# Altium schematic sheet HighSpeedInterfaces.SchDoc: High Speed Interfaces
size A3; ApprovedBy: Diogo Gomes; CheckedBy: Bruno, Candido, Pedro; Author: João Vieira; CompanyName: LART; DrawnBy: João Vieira; Organization: LART; Address1: Morro do lena; Address2: Alto Do Vieiro; Address3: APT 4163, Building D; Revision: v1.4.2; SheetNumber: 7; SheetTotal: 12; ProjectTitle: Autonomous Control Unit; CheckedBy1: G. Candido; CheckedBy2: F. Chen; CheckedBy3: P. Ferreira; CheckedBy4: B. Vicente; CheckedBy5: _; CheckedBy6: _; CheckedBy7: _; CHK_APP_DATE: --/--/--; DSN_APP_DATE: --/--/--; ENG_APP_DATE: --/--/--; Summary: The various High Speed IOs, for now this only includes Ethernet; version_tag: 1.4.2; ImagePath: C:\Users\micron\Desktop
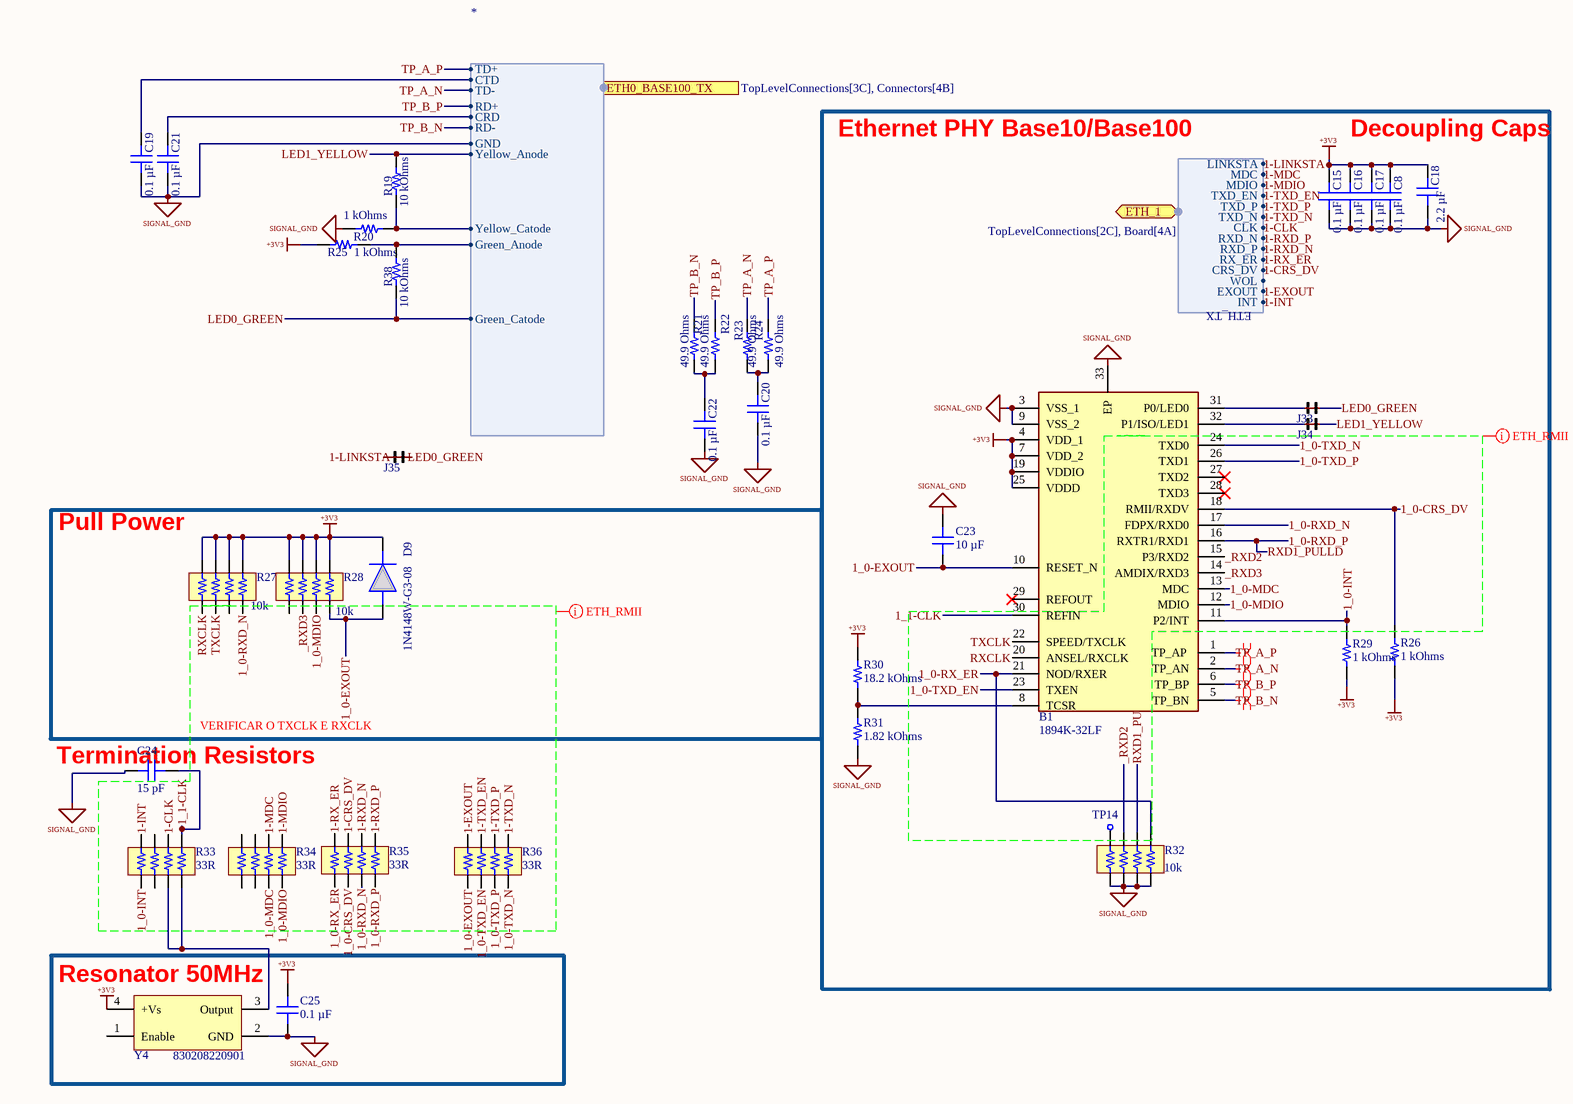
[diagram p0: HighSpeedInterfaces.SchDoc]

## Parts
B1  1894K-32LF  [1894K-32LF]
C8  0.1 µF  [CAP 0402_1005]
C15  0.1 µF  [CAP 0402_1005]
C16  0.1 µF  [CAP 0402_1005]
C17  0.1 µF  [CAP 0402_1005]
C18  2.2 µF  [CAP 0805_2012]
C19  0.1 µF  [CAP 0402_1005]
C20  0.1 µF  [CAP 0402_1005]
C21  0.1 µF  [CAP 0402_1005]
C22  0.1 µF  [CAP 0402_1005]
C23  10 µF  [CAP 0805_2012]
C24  15 pF  [CAP 0402_1005]
C25  0.1 µF  [CAP 0402_1005]
D9  1N4148W-G3-08  [SOD3716X135N]
J33  A solder Bridge  [Solder Bridge 805]  (value not drawn)
J34  A solder Bridge  [Solder Bridge 805]  (value not drawn)
J35  A solder Bridge  [Solder Bridge 805]  (value not drawn)
R19  10 kOhms  [RES 0805_2012]
R20  1 kOhms  [RES 0805_2012]
R21  49.9 Ohms  [RES 0402_1005]
R22  49.9 Ohms  [RES 0402_1005]
R23  49.9 Ohms  [RES 0402_1005]
R24  49.9 Ohms  [RES 0402_1005]
R25  1 kOhms  [RES 0805_2012]
R26  1 kOhms  [RES 0805_2012]
R27  10k  [RESNET 1206-8 CONVEX]
R28  10k  [RESNET 1206-8 CONVEX]
R29  1 kOhms  [RES 0805_2012]
R30  18.2 kOhms  [RES 0805_2012]
R31  1.82 kOhms  [RES 0805_2012]
R32  10k  [RESNET 1206-8 CONVEX]
R33  33R  [RESNET 0804-8 CONVEX]
R34  33R  [RESNET 0804-8 CONVEX]
R35  33R  [RESNET 0804-8 CONVEX]
R36  33R  [RESNET 0804-8 CONVEX]
R38  10 kOhms  [RES 0805_2012]
TP14  TestPad  [Test Pad Small]  (value not drawn)
Y4  830208220901  [WE-SPXO_IQXO-791]

## Blocks framed on the sheet
Pull Power: D9 R27 R28
Resonator 50MHz: C25 Y4

## Ports
ETH0_BASE100_TX (harness *, see TopLevelConnections[3C], Connectors[4B]), ETH_1 (bidir, harness ETH_TX, see TopLevelConnections[2C], Board[4A])

## Harnesses
ETH_TX: MDC, MDIO, TXD_EN, TXD_P, TXD_N, CLK, RXD_N, RXD_P, RX_ER, LINKSTA, CRS_DV, WOL, EXOUT, INT
*: TD+, CTD, TD-, RD+, CRD, RD-, GND, Yellow_Anode, Yellow_Catode, Green_Anode, Green_Catode

## Nets
+3V3: B1.4(VDD_1) B1.7(VDD_2) B1.19(VDDIO) B1.25(VDDD) C8.2 C15.2 C16.2 C17.2 C18.2 C25.1 D9.1(K) R25.2 R26.2 R27.1 R27.2 R27.3 R27.4 R28.5 R28.6 R28.7 R28.8 R29.2 R30.2 Y4.4(+Vs)
SIGNAL_GND: B1.3(VSS_1) B1.9(VSS_2) B1.33(EP) C8.1 C15.1 C16.1 C17.1 C18.1 C19.1 C20.1 C21.1 C22.1 C23.2 C24.2 C25.2 R20.2 R31.1 R32.1 R32.2 R32.3 R32.4 Y4.2(GND) ; port ETH0_BASE100_TX.GND
1-CLK: R33.6 ; port ETH_1.CLK
1-CRS_DV: R35.7 ; port ETH_1.CRS_DV
1-EXOUT: R36.8 ; port ETH_1.EXOUT
1-INT: R33.8 ; port ETH_1.INT
1-LINKSTA: J35.P0 ; port ETH_1.LINKSTA
1-MDC: R34.6 ; port ETH_1.MDC
1-MDIO: R34.5 ; port ETH_1.MDIO
1-RX_ER: R35.8 ; port ETH_1.RX_ER
1-RXD_N: R35.6 ; port ETH_1.RXD_P
1-RXD_P: R35.5 ; port ETH_1.RXD_N
1-TXD_EN: R36.7 ; port ETH_1.TXD_EN
1-TXD_N: R36.5 ; port ETH_1.TXD_N
1-TXD_P: R36.6 ; port ETH_1.TXD_P
1_0-CRS_DV: B1.18(RMII/RXDV) R26.1 R35.2
1_0-EXOUT: B1.10(RESET_N) C23.1 D9.2(A) R28.4 R36.1
1_0-INT: B1.11(P2/INT) R29.1 R33.1
1_0-MDC: B1.13(MDC) R34.3
1_0-MDIO: B1.12(MDIO) R28.3 R34.4
1_0-RX_ER: B1.21(NOD/RXER) R32.5 R35.1
1_0-RXD_N: B1.17(FDPX/RXD0) R27.8 R35.3
1_0-RXD_P: B1.16(RXTR1/RXD1) R32.6 R35.4  [also labelled RXD1_PULLD]
1_0-TXD_EN: B1.23(TXEN) R36.2
1_0-TXD_N: B1.24(TXD0) R36.4
1_0-TXD_P: B1.26(TXD1) R36.3
1_1-CLK: B1.30(REFIN) C24.1 R33.5
_RXD2: B1.15(P3/RXD2) R32.7
_RXD3: B1.14(AMDIX/RXD3) R28.2
LED0_GREEN: J33.P1 J35.P1 R38.1 ; port ETH0_BASE100_TX.Green_Catode
LED1_YELLOW: J34.P1 R19.2 ; port ETH0_BASE100_TX.Yellow_Anode
RXCLK: B1.20(ANSEL/RXCLK) R27.5
TP_A_N: B1.2(TP_AN) R23.2 ; port ETH0_BASE100_TX.TD-
TP_A_P: B1.1(TP_AP) R24.2 ; port ETH0_BASE100_TX.TD+
TP_B_N: B1.5(TP_BN) R21.2 ; port ETH0_BASE100_TX.RD-
TP_B_P: B1.6(TP_BP) R22.2 ; port ETH0_BASE100_TX.RD+
TXCLK: B1.22(SPEED/TXCLK) R27.6
NetB1_8: B1.8(TCSR) R30.1 R31.2
NetB1_31: B1.31(P0/LED0) J33.P0
NetB1_32: B1.32(P1/ISO/LED1) J34.P0
NetC19_2: C19.2 ; port ETH0_BASE100_TX.CTD
NetC20_2: C20.2 R23.1 R24.1
NetC21_2: C21.2 ; port ETH0_BASE100_TX.CRD
NetC22_2: C22.2 R21.1 R22.1
NetR19_1: R19.1 R20.1 ; port ETH0_BASE100_TX.Yellow_Catode
NetR25_1: R25.1 R38.2 ; port ETH0_BASE100_TX.Green_Anode
NetR32_8: R32.8 TP14.P2
NetR33_3: R33.3 R33.4 Y4.3(Output)

Not connected (* = marked no-connect by the designer): B1 27(TXD2)* 28(TXD3)* 29(REFOUT)*; R27 7; R28 1; R33 2 7; R34 1 2 7 8; Y4 1(Enable)

## Layout directives
differential pair; rule Impedance Constraint [Min = 99.00    Max = 101.0    ]; differential pair class ETH_B; rule Matched Net Lengths [Delay Tolerance = 10ps]; rule Differential Pairs Routing [Pref Gap = 0.127mm    Min Gap  = 0.127mm    Max Gap  = 0.127mmPref Width = 0.108mm    Min Width  = 0.076mm    Max Width  = 0.108mm]: TP_B_P
differential pair; rule Impedance Constraint [Min = 99.00    Max = 101.0    ]; rule Impedance Constraint [Min = 99.00    Max = 101.0    ]; differential pair class ETH_B; rule Matched Net Lengths [Delay Tolerance = 10ps]; rule Differential Pairs Routing [Pref Gap = 0.127mm    Min Gap  = 0.127mm    Max Gap  = 0.127mmPref Width = 0.108mm    Min Width  = 0.076mm    Max Width  = 0.108mm]: TP_B_N
differential pair; differential pair class ETH_A; rule Matched Net Lengths [Delay Tolerance = 10ps]; rule Differential Pairs Routing [Pref Gap = 0.127mm    Min Gap  = 0.127mm    Max Gap  = 0.127mmPref Width = 0.108mm    Min Width  = 0.076mm    Max Width  = 0.108mm]: TP_A_P
differential pair; rule Impedance Constraint [Min = 99.00    Max = 101.0    ]; differential pair class ETH_A; rule Matched Net Lengths [Delay Tolerance = 10ps]; rule Differential Pairs Routing [Pref Gap = 0.127mm    Min Gap  = 0.127mm    Max Gap  = 0.127mmPref Width = 0.108mm    Min Width  = 0.076mm    Max Width  = 0.108mm]: TP_A_N
rule Width Constraint [Pref Impedance = 50.00ohms    Min Impedance = 50.00ohms    Max Impedance = 50.00ohms]: 1-CLK, 1-CRS_DV, 1-EXOUT, 1-INT, 1-MDC, 1-MDIO, 1-RX_ER, 1-RXD_N, 1-RXD_P, 1-TXD_EN, 1-TXD_N, 1-TXD_P, 1_0-CRS_DV, 1_0-EXOUT, 1_0-INT, 1_0-MDC, 1_0-MDIO, 1_0-RX_ER, 1_0-RXD_N, 1_0-RXD_P, 1_0-TXD_EN, 1_0-TXD_N, 1_0-TXD_P, 1_1-CLK, _RXD2, _RXD3, RXCLK, RXD1_PULLD, TXCLK

## Notes on the sheet
- Ethernet PHY Base10/Base100
- Decoupling Caps
- (near C24) VERIFICAR O TXCLK E RXCLK
- (near C24) Termination Resistors
- Title:
- Author:
- Checked By:
- Approved:
- Size:
- Date:
- Git Hash:
- A3
- Prj:
- Variant:
- SW Version:
- Description:

## Library data of the parts
B1 = 1894K-32LF: The IDT1894-32 is a low-power, physical-layer device (PHY) that supports the ISO/IEC 10Base-T and 100Base-TX Carrier-Sense Multiple Access/Collision Detection (CSMA/CD) Ethernet standards, ISO/IEC 8802-3. The IDT1894-32 is intended for MII, Node applications that require the Auto-MDIX feature that automatically corrects crossover errors in plant wiring. The IDT1894-32 incorporates Digital-Signal Processing (DSP) control in its Physical-Medium Dependent (PMD) sub layer. As a result, it can transmit and recei; Manufacturer_Name: Renesas Electronics; Geometry.Height: 1mm; Manufacturer_Part_Number: 1894K-32LF; Mouser Part Number: 972-1894K-32LF; Mouser Price/Stock: https://www.mouser.co.uk/ProductDetail/Renesas-IDT/1894K-32LF?qs=JcGQCygHkIbsoRijcJxryA%3D%3D; Arrow Part Number: *; Arrow Price/Stock: *; Datasheet Link: https://www.idt.com/document/dst/1894-32-datasheet
C8 C15-C17 C19-C22 C25 = CL05B104KP5VPNC: CAP CER 100NF 10V X7R 0402; manufacturer: Samsung Electro-Mechanics; Tolerance: ±10%; Part Number: CL05B104KP5VPNC; Value: 0.1 µF; Applications: Automotive; Capacitance: 0.1 µF; componentlink1description: Datasheet; componentlink1url: https://mm.digikey.com/Volume0/opasdata/d220001/medias/docus/5458/CL05B104KP5VPNC_Spec.pdf; componentlink2description: DigiKey Link; componentlink2url: https://www.digikey.com/en/products/detail/samsung-electro-mechanics/CL05B104KP5VPNC/20498482; Device Package: 0402 (1005 Metric); lastupdated: 02/02/2024 20:03:11; Lifecycle Status: Active; Minimum Order: 1; Mounting Type: Surface Mount, MLCC; Operating Temperature: -55°C ~ 125°C; Package / Case: 0402 (1005 Metric); packaging: TapeAndReel; partid: 56690; price: 0.01; Ratings: AEC-Q200; series: CL; Size / Dimension: 0.039" L x 0.020" W (1.00mm x 0.50mm); Supplier 1: DigiKey; Supplier Part Number 1: 1276-CL05B104KP5VPNCCT-ND; Temperature Coefficient: X7R; Thickness (Max): 0.022" (0.55mm); Voltage - Rated: 10V
C18 = 0805B225K250CT: CAP CER 2.2UF 25V X7R 0805; manufacturer: Walsin Technology Corporation; Tolerance: ±10%; Part Number: 0805B225K250CT; Value: 2.2 µF; Applications: General Purpose; Capacitance: 2.2 µF; componentlink1description: Datasheet; componentlink1url: https://www.passivecomponent.com/wp-content/uploads/datasheet/WTC_MLCC_General_Purpose.pdf; componentlink2description: DigiKey Link; componentlink2url: https://www.digikey.com/en/products/detail/walsin-technology-corporation/0805B225K250CT/14836806; Device Package: 0805 (2012 Metric); lastupdated: 09/02/2024 20:15:01; Lifecycle Status: Active; Minimum Order: 1; Mounting Type: Surface Mount, MLCC; Operating Temperature: -55°C ~ 125°C; Package / Case: 0805 (2012 Metric); packaging: TapeAndReel; partid: 40661; Part Status: Active; price: 0.03; series: -; Size / Dimension: 0.079" L x 0.049" W (2.00mm x 1.25mm); Supplier 1: DigiKey; Supplier Part Number 1: 1292-0805B225K250CT-ND; Temperature Coefficient: X7R; Thickness (Max): 0.057" (1.45mm); Voltage - Rated: 25V
C23 = NMC0805X5R106K6.3TRPLP2KF: CAP SMT080510F6.3VDC 10uF Specialised; manufacturer: NIC Components Corp; Temperature Coefficient: X5R; Tolerance: ±10%; Voltage - Rated: 6.3V; Part Number: NMC0805X5R106K6.3TRPLP2KF; Value: 10 µF; Applications: General Purpose; Capacitance: 10 µF; componentlink1description: Datasheet; componentlink1url: https://www.niccomp.com/quickbuilder/qbpn.php?pNumber=NMC0805X5R106K6.3TRPLP2KF; componentlink2description: DigiKey Link; componentlink2url: https://www.digikey.com/en/products/detail/nic-components-corp/NMC0805X5R106K6-3TRPLP2KF/18896026; Device Package: 0805 (2012 Metric); Features: Low ESL, Low ESR; lastupdated: 09/02/2024 20:13:27; Lifecycle Status: Active; Minimum Order: 1; Mounting Type: Surface Mount, MLCC; Operating Temperature: -55°C ~ 85°C; Package / Case: 0805 (2012 Metric); packaging: TapeAndReel; partid: 56029; price: 0.03; series: NMC High CV; Size / Dimension: 0.079" L x 0.049" W (2.00mm x 1.25mm); Supplier 1: DigiKey; Supplier Part Number 1: 4988-NMC0805X5R106K6.3TRPLP2KFCT-ND; Thickness (Max): 0.057" (1.45mm)
C24 = CBR04C150J5GAC: CAP CER 15PF 50V C0G/NP0 0402; manufacturer: KEMET; Temperature Coefficient: C0G, NP0; Tolerance: ±5%; Part Number: CBR04C150J5GAC; Value: 15 pF; Applications: RF, Microwave, High Frequency; Capacitance: 15 pF; componentlink1description: Datasheet; componentlink1url: https://api.kemet.com/component-edge/download/datasheet/CBR04C150J5GAC.pdf; componentlink2description: DigiKey Link; componentlink2url: https://www.digikey.com/en/products/detail/kemet/CBR04C150J5GAC/2732287; Device Package: 0402 (1005 Metric); Features: High Q, Low Loss, Ultra Low ESR; lastupdated: 09/02/2024 20:04:38; Lifecycle Status: Active; Minimum Order: 1; Mounting Type: Surface Mount, MLCC; Operating Temperature: -55°C ~ 125°C; Package / Case: 0402 (1005 Metric); packaging: TapeAndReel; partid: 1728; Part Status: Active; price: 0.02; series: CBR-SMD RF C0G; Size / Dimension: 0.039" L x 0.020" W (1.00mm x 0.50mm); Supplier 1: DigiKey; Supplier Part Number 1: 399-6170-1-ND; Thickness (Max): 0.022" (0.55mm); Voltage - Rated: 50V
D9 = 1N4148W-G3-08: Diodes - General Purpose, Power, Switching 100 Volt 150mA 4ns 500mA IFSM; Manufacturer_Name: Vishay; Geometry.Height: 1.35mm; Manufacturer_Part_Number: 1N4148W-G3-08; Mouser Part Number: 78-1N4148W-G3-08; Mouser Price/Stock: https://www.mouser.co.uk/ProductDetail/Vishay-Semiconductors/1N4148W-G3-08?qs=uS%252BVSIFnvp46StDBB15x4Q%3D%3D; Arrow Part Number: 1N4148W-G3-08; Arrow Price/Stock: https://www.arrow.com/en/products/1n4148w-g3-08/vishay; Datasheet Link: https://componentsearchengine.com/Datasheets/1/1N4148W-G3-08.pdf
J33-J35 = Solder Bridge 805
R19 R38 = RNCS0805BKE10K0: RES 10K OHM 0.1% 1/10W 0805; Manufacturer: Stackpole Electronics Inc; Power (Watts): 0.1W, 1/10W; Temperature Coefficient: ±25ppm/°C; Part Number: RNCS0805BKE10K0; Value: 10 kOhms; ComponentLink1Description: Datasheet; ComponentLink1URL: https://www.seielect.com/catalog/sei-rncs_rnch.pdf; ComponentLink2Description: DigiKey Link; ComponentLink2URL: https://www.digikey.com/en/products/detail/stackpole-electronics-inc/RNCS0805BKE10K0/1800067; Composition: Thin Film; Device Package: 0805 (2012 Metric); Features: Anti-Corrosive, Automotive AEC-Q200, Moisture Resistant; Height - Seated (Max): 0.026" (0.65mm); LastUpdated: 02/02/2024 21:00:48; Lifecycle Status: Active; Minimum Order: 1; Number of Terminations: 2; Operating Temperature: -55°C ~ 155°C; Package / Case: 0805 (2012 Metric); Packaging: TapeAndReel; PartId: 27713; Part Status: Active; Price: 0.07; Ratings: AEC-Q200; Resistance: 10 kOhms; Series: RNCS; Size / Dimension: 0.079" L x 0.049" W (2.00mm x 1.25mm); Supplier 1: DigiKey; Supplier Part Number 1: RNCS0805BKE10K0CT-ND; Supplier Device Package: 0805; Tolerance: ±0.1%
R20 R25 R26 R29 = RNCS0805BKE1K00: RES 1K OHM 0.1% 1/10W 0805; Manufacturer: Stackpole Electronics Inc; Power (Watts): 0.1W, 1/10W; Temperature Coefficient: ±25ppm/°C; Part Number: RNCS0805BKE1K00; Value: 1 kOhms; ComponentLink1Description: Datasheet; ComponentLink1URL: https://www.seielect.com/catalog/sei-rncs_rnch.pdf; ComponentLink2Description: DigiKey Link; ComponentLink2URL: https://www.digikey.com/en/products/detail/stackpole-electronics-inc/RNCS0805BKE1K00/1800073; Composition: Thin Film; Device Package: 0805 (2012 Metric); Features: Anti-Corrosive, Automotive AEC-Q200, Moisture Resistant; Height - Seated (Max): 0.026" (0.65mm); LastUpdated: 02/02/2024 21:00:48; Lifecycle Status: Active; Minimum Order: 1; Number of Terminations: 2; Operating Temperature: -55°C ~ 155°C; Package / Case: 0805 (2012 Metric); Packaging: TapeAndReel; PartId: 27715; Part Status: Active; Price: 0.07; Ratings: AEC-Q200; Resistance: 1 kOhms; Series: RNCS; Size / Dimension: 0.079" L x 0.049" W (2.00mm x 1.25mm); Supplier 1: DigiKey; Supplier Part Number 1: RNCS0805BKE1K00CT-ND; Supplier Device Package: 0805; Tolerance: ±0.1%
R21-R24 = CRCW040249R9FKTD: RES SMD 49.9 OHM 1% 1/16W 0402; Manufacturer: Vishay Dale; Power (Watts): 0.063W, 1/16W; Temperature Coefficient: ±100ppm/°C; Part Number: CRCW040249R9FKTD; Value: 49.9 Ohms; ComponentLink1Description: Datasheet; ComponentLink1URL: http://www.vishay.com/docs/20008/dcrcw.pdf; ComponentLink2Description: DigiKey Link; ComponentLink2URL: https://www.digikey.com/en/products/detail/vishay-dale/CRCW040249R9FKTD/1221372; Composition: Thick Film; Device Package: 0402 (1005 Metric); Features: Automotive AEC-Q200; Height - Seated (Max): 0.016" (0.40mm); LastUpdated: 09/02/2024 20:30:10; Lifecycle Status: Active; Minimum Order: 1; Number of Terminations: 2; Operating Temperature: -55°C ~ 155°C; Package / Case: 0402 (1005 Metric); Packaging: TapeAndReel; PartId: 5707; Part Status: Active; Price: 0.01; Ratings: AEC-Q200; Resistance: 49.9 Ohms; Series: CRCW; Size / Dimension: 0.039" L x 0.020" W (1.00mm x 0.50mm); Supplier 1: DigiKey; Supplier Part Number 1: 541-2963-1-ND; Supplier Device Package: 0402; Tolerance: ±1%
R27 R28 R32 = ACASA1001S1002P100: RES ARRAY 4 RES MULT OHM 1206; Manufacturer: Vishay Beyschlag; Circuit Type: Isolated; Number of Resistors: 4; Power Per Element: 100mW; Resistance (Ohms): 1k, 10k; Resistor Matching Ratio: ±0.05%; Resistor-Ratio-Drift: ±15ppm/°C; Temperature Coefficient: ±25ppm/°C; Tolerance: ±0.1%; Part Number: ACASA1001S1002P100; Applications: Voltage Divider (TCR Matched); ComponentLink1Description: Datasheet; ComponentLink1URL: http://www.vishay.com/docs/28751/acasprec.pdf; ComponentLink2Description: DigiKey Link; ComponentLink2URL: http://digikey.com/product-detail/en/vishay-beyschlag/ACASA1001S1002P100/749-1017-1-ND/4741023; Height - Seated (Max): 0.022" (0.55mm); LastUpdated: 02/02/2024 21:35:30; Lifecycle Status: Active; Minimum Order: 1; Mounting Type: Surface Mount; Number of Pins: 8; Operating Temperature: -55°C ~ 125°C; Package / Case: 1206 (3216 Metric), Convex, Long Side Terminals; Packaging: TapeAndReel; PartId: 354; Part Status: Active; Price: 0.24; Series: ACA - Precision; Size / Dimension: 0.126" L x 0.059" W (3.20mm x 1.50mm); Supplier 1: DigiKey; Supplier Part Number 1: 749-1017-1-ND
R30 = RN73C2A18K2BTDF: RES SMD 18.2KOHM 0.1% 1/10W 0805; Manufacturer: TE Connectivity Passive Product; Power (Watts): 0.1W, 1/10W; Temperature Coefficient: ±10ppm/°C; Part Number: RN73C2A18K2BTDF; Value: 18.2 kOhms; ComponentLink1Description: Datasheet; ComponentLink1URL: https://www.te.com/commerce/DocumentDelivery/DDEController?Action=srchrtrv&DocNm=1773270&DocType=DS&DocLang=English; ComponentLink2Description: DigiKey Link; ComponentLink2URL: https://www.digikey.com/en/products/detail/te-connectivity-passive-product/RN73C2A18K2BTDF/2373970; Composition: Thin Film; Device Package: 0805 (2012 Metric); Height - Seated (Max): 0.026" (0.65mm); LastUpdated: 08/02/2024 21:02:38; Lifecycle Status: Active; Minimum Order: 1; Number of Terminations: 2; Operating Temperature: -55°C ~ 155°C; Package / Case: 0805 (2012 Metric); Packaging: TapeAndReel; PartId: 27941; Part Status: Active; Price: 0.36; Resistance: 18.2 kOhms; Series: RN73, Holsworthy; Size / Dimension: 0.079" L x 0.049" W (2.00mm x 1.25mm); Supplier 1: DigiKey; Supplier Part Number 1: A103339CT-ND; Supplier Device Package: 0805; Tolerance: ±0.1%
R31 = RG2012P-1821-B-T5: RES SMD 1.82K OHM 0.1% 1/8W 0805; Manufacturer: Susumu; Power (Watts): 0.125W, 1/8W; Temperature Coefficient: ±25ppm/°C; Part Number: RG2012P-1821-B-T5; Value: 1.82 kOhms; ComponentLink1Description: Datasheet; ComponentLink1URL: http://www.susumu.co.jp/common/pdf/n_catalog_partition01_en.pdf; ComponentLink2Description: DigiKey Link; ComponentLink2URL: https://www.digikey.com/en/products/detail/susumu/RG2012P-1821-B-T5/1240695; Composition: Thin Film; Device Package: 0805 (2012 Metric); Features: Anti-Sulfur, Automotive AEC-Q200; Height - Seated (Max): 0.020" (0.50mm); LastUpdated: 08/02/2024 21:02:32; Lifecycle Status: Active; Minimum Order: 1; Number of Terminations: 2; Operating Temperature: -55°C ~ 155°C; Package / Case: 0805 (2012 Metric); Packaging: TapeAndReel; PartId: 29209; Part Status: Active; Price: 0.05; Ratings: AEC-Q200; Resistance: 1.82 kOhms; Series: RG; Size / Dimension: 0.079" L x 0.049" W (2.00mm x 1.25mm); Supplier 1: DigiKey; Supplier Part Number 1: RG20P1.82KBCT-ND; Supplier Device Package: 0805; Tolerance: ±0.1%
R33-R36 = EXB-28V433JX: RES ARRAY 4 RES 43K OHM 0804; Manufacturer: Panasonic Electronic Components; Circuit Type: Isolated; Number of Resistors: 4; Power Per Element: 62.5mW; Temperature Coefficient: ±200ppm/°C; Tolerance: ±5%; Part Number: EXB-28V433JX; Applications: Automotive AEC-Q200; ComponentLink1Description: Datasheet; ComponentLink1URL: https://industrial.panasonic.com/cdbs/www-data/pdf/AOC0000/AOC0000C14.pdf; ComponentLink2Description: DigiKey Link; ComponentLink2URL: https://www.digikey.com/en/products/detail/panasonic-electronic-components/EXB-28V433JX/417403; Height - Seated (Max): 0.018" (0.45mm); LastUpdated: 02/02/2024 21:35:40; Lifecycle Status: Active; Minimum Order: 1; Mounting Type: Surface Mount; Number of Pins: 8; Operating Temperature: -55°C ~ 125°C; Package / Case: 0804, Convex, Long Side Terminals; Packaging: TapeAndReel; PartId: 428; Part Status: Active; Price: 0.03; Resistance (Ohms): 43k; Series: EXB; Size / Dimension: 0.079" L x 0.039" W (2.00mm x 1.00mm); Supplier 1: DigiKey; Supplier Part Number 1: Y7433CT-ND; Supplier Device Package: 0804
Y4 = 830208220901: WE-SPXO Simple Packaged Quartz Oscillator, SMT, IQXO-791, 50MHz, 3.3V; Manufacturer: Wurth Elektronik; Frequency Stability: +/-25ppm; ComponentLink1Description: Website Link; ComponentLink1URL: https://www.we-online.com/redexpert/article/830208220901?ad; ComponentLink2Description: Datasheet Link; ComponentLink2URL: https://www.we-online.com/redexpert/spec/830208220901?ad; Manufacturer Part Number: 830208220901; Category: Oscillators; Match Code: WE-SPXO; Mount: Surface Mount; Operating Temperature Max: 70°C; Operating Temperature Min: -20°C; Packaging: Tape and Reel; Case/Size Code: IQXO-791; Length: 2.5mm; Width: 2mm; Height: 1mm; Frequency: 50MHz; Supply Voltage: 3.3V